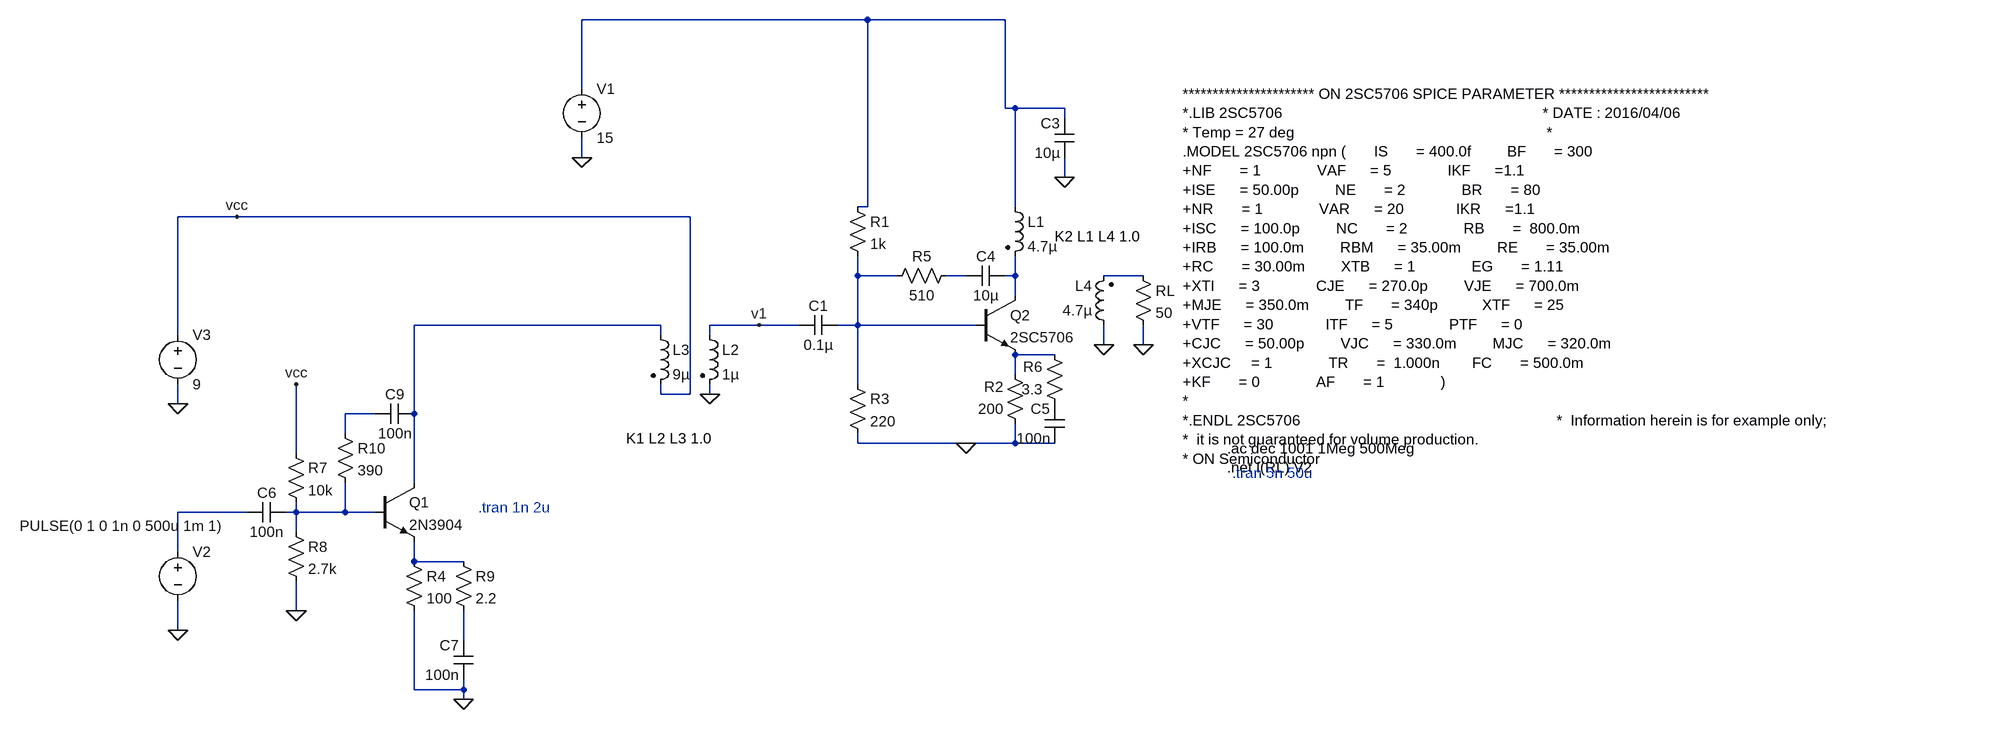
[diagram p0: schematic 2n3904_2sc5706.asc]
2n3904_2sc5706.asc, the LTspice schematic file:
Version 4
SHEET 1 2420 1184
WIRE 144 16 -320 16
WIRE 368 16 144 16
WIRE -320 128 -320 16
WIRE 368 160 368 16
WIRE 384 160 368 160
WIRE 464 160 384 160
WIRE 464 176 464 160
WIRE -320 240 -320 208
WIRE 464 272 464 240
WIRE 144 320 144 16
WIRE 144 320 128 320
WIRE 384 320 384 160
WIRE -880 336 -976 336
WIRE -144 336 -880 336
WIRE 128 432 128 400
WIRE 192 432 128 432
WIRE 304 432 272 432
WIRE 384 432 384 400
WIRE 384 432 368 432
WIRE 592 432 528 432
WIRE 384 464 384 432
WIRE -192 512 -592 512
WIRE -32 512 -112 512
WIRE 32 512 -32 512
WIRE 128 512 128 432
WIRE 128 512 96 512
WIRE 320 512 128 512
WIRE -976 528 -976 336
WIRE -192 528 -192 512
WIRE -112 528 -112 512
WIRE 528 544 528 512
WIRE 592 544 592 512
WIRE 448 560 384 560
WIRE 384 592 384 560
WIRE 128 608 128 512
WIRE -192 624 -192 608
WIRE -144 624 -144 336
WIRE -144 624 -192 624
WIRE -112 624 -112 608
WIRE -976 640 -976 608
WIRE -656 656 -704 656
WIRE -592 656 -592 512
WIRE -704 688 -704 656
WIRE 128 704 128 688
WIRE 304 704 128 704
WIRE 384 704 384 672
WIRE 384 704 304 704
WIRE 448 704 384 704
WIRE -784 720 -784 608
WIRE -592 768 -592 656
WIRE -864 816 -976 816
WIRE -784 816 -784 800
WIRE -784 816 -800 816
WIRE -704 816 -704 768
WIRE -704 816 -784 816
WIRE -656 816 -704 816
WIRE -784 848 -784 816
WIRE -976 880 -976 816
WIRE -592 896 -592 864
WIRE -512 896 -592 896
WIRE -784 976 -784 928
WIRE -976 1008 -976 960
WIRE -512 1024 -512 976
WIRE -592 1104 -592 976
WIRE -512 1104 -512 1088
WIRE -512 1104 -592 1104
WIRE -512 1120 -512 1104
FLAG -320 240 0
FLAG 304 704 0
FLAG 592 544 0
FLAG 464 272 0
FLAG -112 624 0
FLAG -32 512 v1
FLAG -512 1120 0
FLAG -784 976 0
FLAG -880 336 vcc
FLAG -784 608 vcc
FLAG -976 1008 0
FLAG -976 640 0
FLAG 528 544 0
DATAFLAG 160 512 "$"
DATAFLAG 384 576 "$"
DATAFLAG -672 816 "$"
DATAFLAG -544 896 "$"
SYMBOL npn 320 464 R0
SYMATTR InstName Q2
SYMATTR Value 2SC5706
SYMBOL res 112 304 R0
SYMATTR InstName R1
SYMATTR Value 1k
SYMBOL voltage -320 112 R0
SYMATTR InstName V1
SYMATTR Value 15
SYMBOL ind2 368 304 R0
SYMATTR InstName L1
SYMATTR Value 4.7µ
SYMATTR Type ind
SYMBOL cap 96 496 R90
WINDOW 0 0 32 VBottom 2
WINDOW 3 32 32 VTop 2
SYMATTR InstName C1
SYMATTR Value 0.1µ
SYMBOL res 576 416 R0
SYMATTR InstName RL
SYMATTR Value 50
SYMBOL voltage -976 864 R0
WINDOW 3 -257 -26 Left 2
SYMATTR Value PULSE(0 1 0 1n 0 500u 1m 1)
SYMATTR InstName V2
SYMATTR Value2 AC 1
SYMATTR SpiceLine Rser=50
SYMBOL cap 480 240 R180
WINDOW 0 24 56 Left 2
WINDOW 3 24 8 Left 2
SYMATTR InstName C3
SYMATTR Value 10µ
SYMBOL ind2 -128 512 R0
SYMATTR InstName L2
SYMATTR Value 1µ
SYMATTR Type ind
SYMBOL ind2 -208 512 R0
SYMATTR InstName L3
SYMATTR Value 9µ
SYMATTR Type ind
SYMBOL res 400 688 R180
WINDOW 0 36 76 Left 2
WINDOW 3 36 40 Left 2
SYMATTR InstName R2
SYMATTR Value 200
SYMBOL res 112 592 R0
SYMATTR InstName R3
SYMATTR Value 220
SYMBOL res 288 416 R90
WINDOW 0 0 56 VBottom 2
WINDOW 3 32 56 VTop 2
SYMATTR InstName R5
SYMATTR Value 510
SYMBOL cap 368 416 R90
WINDOW 0 0 32 VBottom 2
WINDOW 3 32 32 VTop 2
SYMATTR InstName C4
SYMATTR Value 10µ
SYMBOL npn -656 768 R0
SYMATTR InstName Q1
SYMATTR Value 2N3904
SYMBOL voltage -976 512 R0
SYMATTR InstName V3
SYMATTR Value 9
SYMBOL cap -800 800 R90
WINDOW 0 0 32 VBottom 2
WINDOW 3 32 32 VTop 2
SYMATTR InstName C6
SYMATTR Value 100n
SYMBOL res -608 880 R0
SYMATTR InstName R4
SYMATTR Value 100
SYMBOL res -800 704 R0
SYMATTR InstName R7
SYMATTR Value 10k
SYMBOL res -800 832 R0
SYMATTR InstName R8
SYMATTR Value 2.7k
SYMBOL cap -496 1088 R180
WINDOW 0 24 56 Left 2
WINDOW 3 24 8 Left 2
SYMATTR InstName C7
SYMATTR Value 100n
SYMBOL res -528 880 R0
SYMATTR InstName R9
SYMATTR Value 2.2
SYMBOL cap -656 672 R270
WINDOW 0 32 32 VTop 2
WINDOW 3 0 32 VBottom 2
SYMATTR InstName C9
SYMATTR Value 100n
SYMBOL res -720 672 R0
SYMATTR InstName R10
SYMATTR Value 390
SYMBOL res 464 656 R180
WINDOW 0 36 76 Left 2
WINDOW 3 36 40 Left 2
SYMATTR InstName R6
SYMATTR Value 3.3
SYMBOL cap 464 704 R180
WINDOW 0 24 56 Left 2
WINDOW 3 24 8 Left 2
SYMATTR InstName C5
SYMATTR Value 100n
SYMBOL ind2 544 528 R180
WINDOW 0 36 80 Left 2
WINDOW 3 36 40 Left 2
SYMATTR InstName L4
SYMATTR Value 4.7µ
SYMATTR Type ind
TEXT 728 712 Left 2 !.ac dec 1001 1Meg 500Meg\n.net I(RL) V2
TEXT 736 752 Left 2 ;.tran 5n 50u
TEXT -248 696 Left 2 !K1 L2 L3 1.0
TEXT 656 136 Left 2 !********************** ON 2SC5706 SPICE PARAMETER *************************\n*.LIB 2SC5706                                                                 * DATE : 2016/04/06                                                           \n* Temp = 27 deg                                                               *                                                                             \n.MODEL 2SC5706 npn (       IS       = 400.0f         BF       = 300           \n+NF       = 1              VAF      = 5              IKF      =1.1            \n+ISE      = 50.00p         NE       = 2              BR       = 80            \n+NR       = 1              VAR      = 20             IKR      =1.1            \n+ISC      = 100.0p         NC       = 2              RB       =  800.0m       \n+IRB      = 100.0m         RBM      = 35.00m         RE       = 35.00m        \n+RC       = 30.00m         XTB      = 1              EG       = 1.11          \n+XTI      = 3              CJE      = 270.0p         VJE      = 700.0m        \n+MJE      = 350.0m         TF       = 340p           XTF      = 25            \n+VTF      = 30             ITF      = 5              PTF      = 0             \n+CJC      = 50.00p         VJC      = 330.0m         MJC      = 320.0m        \n+XCJC     = 1              TR       =  1.000n        FC       = 500.0m        \n+KF       = 0              AF       = 1              )                        \n*                                                                             \n*.ENDL 2SC5706                                                                *  Information herein is for example only;                                    \n*  it is not guaranteed for volume production.                                \n* ON Semiconductor
TEXT -488 808 Left 2 ;.tran 1n 2u
TEXT 448 368 Left 2 !K2 L1 L4 1.0

The netlist it stands for:
* 2n3904_2sc5706.asc
Q2 N004 N002 N007 0 2SC5706
R1 N001 N002 1k
V1 N001 0 15
L1 N001 N004 4.7µ
C1 N002 v1 0.1µ
RL N005 0 50
V2 N009 0 PULSE(0 1 0 1n 0 500u 1m 1) AC 1 Rser=50
C3 0 N001 10µ
L2 v1 0 1µ
L3 N006 vcc 9µ
R2 0 N007 200
R3 N002 0 220
R5 N003 N002 510
C4 N004 N003 10µ
Q1 N006 N010 N011 0 2N3904
V3 vcc 0 9
C6 N010 N009 100n
R4 N011 0 100
R7 vcc N010 10k
R8 N010 0 2.7k
C7 0 N012 100n
R9 N011 N012 2.2
C9 N008 N006 100n
R10 N008 N010 390
R6 P001 N007 3.3
C5 0 P001 100n
L4 0 N005 4.7µ
.model NPN NPN
.model PNP PNP
.lib standard.bjt
.ac dec 1001 1Meg 500Meg
.net I(RL) V2
* .tran 5n 50u
K1 L2 L3 1.0
********************** ON 2SC5706 SPICE PARAMETER *************************
*.LIB 2SC5706                                                                 * DATE : 2016/04/06
* Temp = 27 deg                                                               *
.MODEL 2SC5706 npn (       IS       = 400.0f         BF       = 300
+NF       = 1              VAF      = 5              IKF      =1.1
+ISE      = 50.00p         NE       = 2              BR       = 80
+NR       = 1              VAR      = 20             IKR      =1.1
+ISC      = 100.0p         NC       = 2              RB       =  800.0m
+IRB      = 100.0m         RBM      = 35.00m         RE       = 35.00m
+RC       = 30.00m         XTB      = 1              EG       = 1.11
+XTI      = 3              CJE      = 270.0p         VJE      = 700.0m
+MJE      = 350.0m         TF       = 340p           XTF      = 25
+VTF      = 30             ITF      = 5              PTF      = 0
+CJC      = 50.00p         VJC      = 330.0m         MJC      = 320.0m
+XCJC     = 1              TR       =  1.000n        FC       = 500.0m
+KF       = 0              AF       = 1              )
*
*.ENDL 2SC5706                                                                *  Information herein is for example only;
*  it is not guaranteed for volume production.
* ON Semiconductor
* .tran 1n 2u
K2 L1 L4 1.0
.backanno
.end